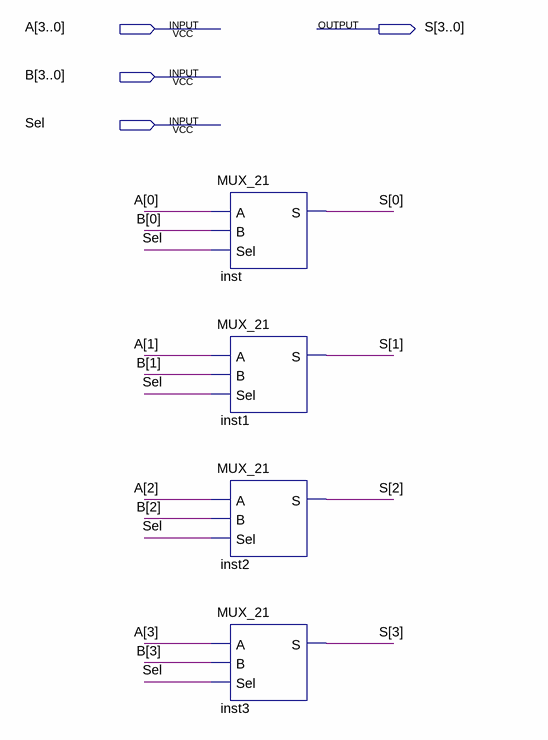
[diagram p0: schematic sheet]
// Quartus schematic MUX_21_4_BITS.bdf as structural Verilog: 4 symbols, 4 pins
module MUX_21_4_BITS (
  input  [3:0] A,
  input  [3:0] B,
  input  Sel,
  output [3:0] S
);

  MUX_21 inst (.A(A[0]), .B(B[0]), .Sel(Sel), .S(S[0]));
  MUX_21 inst1 (.A(A[1]), .B(B[1]), .Sel(Sel), .S(S[1]));
  MUX_21 inst2 (.A(A[2]), .B(B[2]), .Sel(Sel), .S(S[2]));
  MUX_21 inst3 (.A(A[3]), .B(B[3]), .Sel(Sel), .S(S[3]));
endmodule
